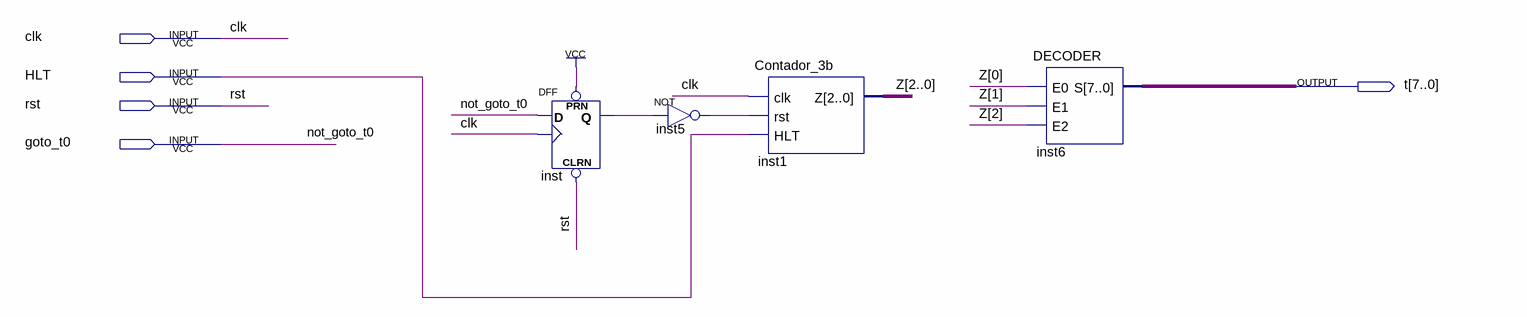
[diagram p0: schematic sheet]
// Quartus schematic Temporizador.bdf as structural Verilog: 4 symbols, 5 pins
module Temporizador (
  input  clk,
  input  HLT,
  input  rst,
  input  goto_t0,
  output [7:0] t
);

  wire inst5_out, inst_q;
  wire [2:0] Z;

  DFF inst (.CLRN(rst), .CLK(clk), .D(goto_t0), .PRN(1'b1), .Q(inst_q));
  not inst5 (inst5_out, inst_q);
  Contador_3b inst1 (.clk(clk), .rst(inst5_out), .HLT(HLT), .Z(Z));
  DECODER inst6 (.E0(Z[0]), .E1(Z[1]), .E2(Z[2]), .S(t));

  // Other names for the same wires on the sheet: not_goto_t0 = goto_t0
endmodule
